# Altium schematic sheet [12] - TK2560_uSD.SchDoc
size A4; SheetNumber: 13; SheetTotal: 15
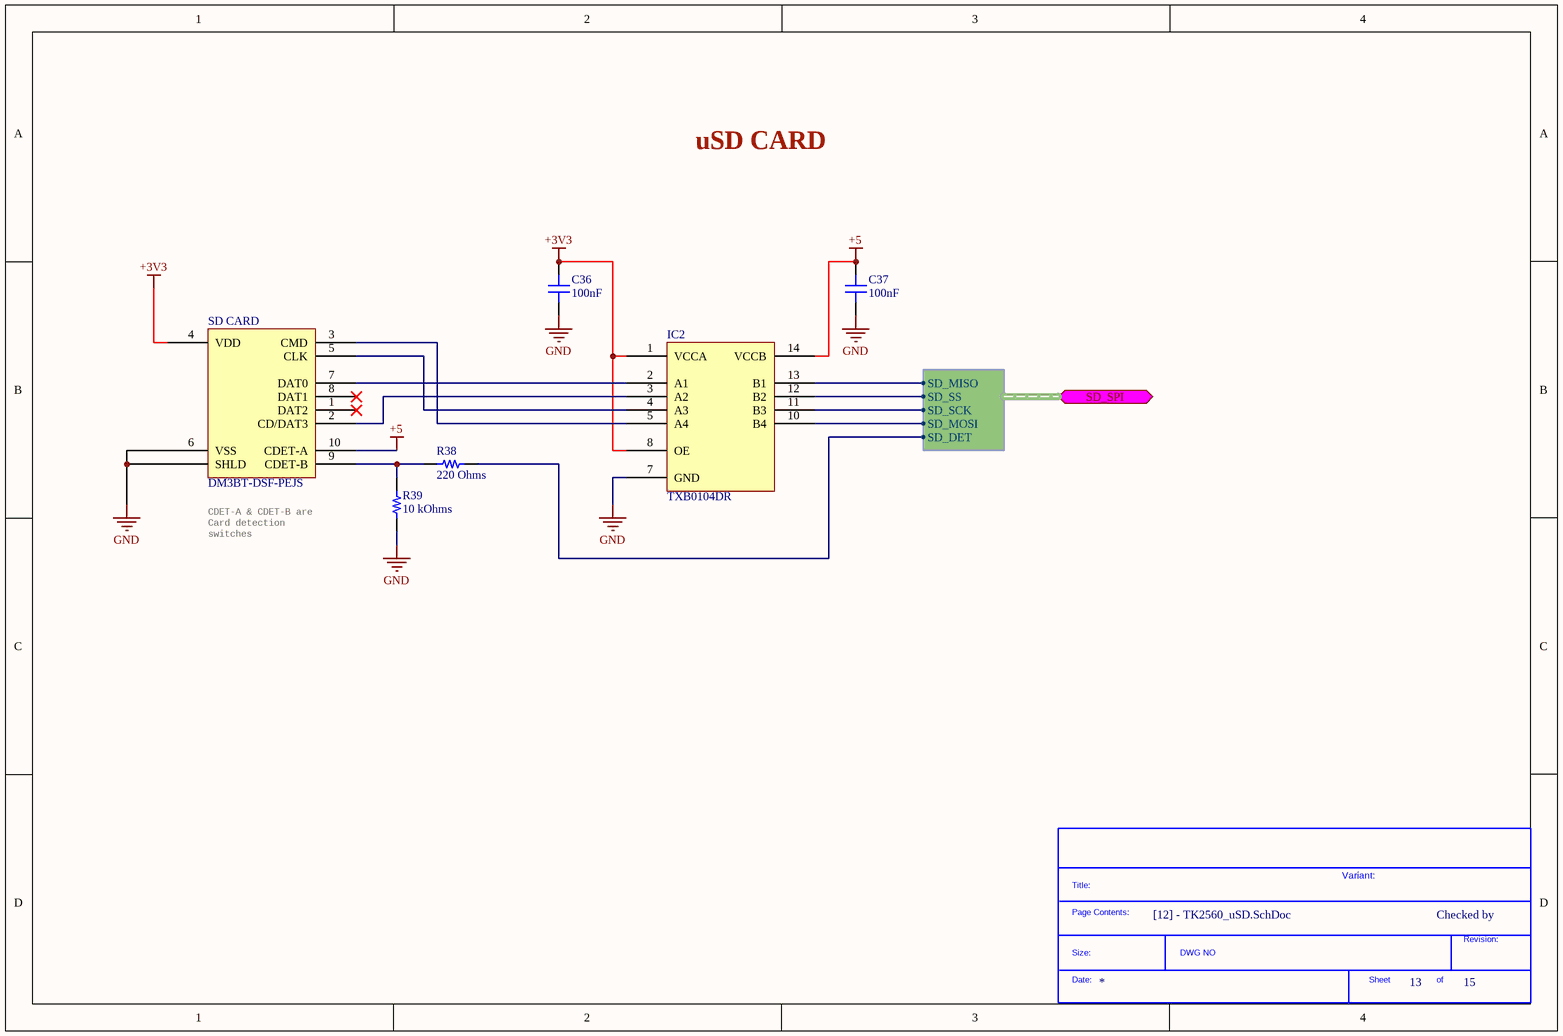
[diagram p0: [12] - TK2560_uSD.SchDoc]

## Parts
*?  SDTitleBlock  (value not drawn)  (graphical)
C36  100nF  [CAP 0805_2012]
C37  100nF  [CAP 0805_2012]
IC2  TXB0104DR  [TI SOIC-14 D]
R38  220 Ohms  [RES 0805_2012]
R39  10 kOhms  [RES 0805_2012]
SD_CARD  DM3BT-DSF-PEJS  [HIROSE DM3BT-DSF-PEJS]

## Ports
SD_SPI (bidir, harness SD_SPI)

## Harnesses
SD_SPI: SD_MISO, SD_SS, SD_SCK, SD_MOSI, SD_DET

## Nets
+3V3: C36.2 IC2.1(VCCA) IC2.8(OE) SD_CARD.4(VDD)
+5: C37.2 IC2.14(VCCB) SD_CARD.10(CDET-A)
GND: C36.1 C37.1 IC2.7(GND) R39.2 SD_CARD.6(VSS) SD_CARD.S(SHLD)
NetIC2_2: IC2.2(A1) SD_CARD.7(DAT0)
NetIC2_3: IC2.3(A2) SD_CARD.2(CD/DAT3)
NetIC2_4: IC2.4(A3) SD_CARD.5(CLK)
NetIC2_5: IC2.5(A4) SD_CARD.3(CMD)
NetIC2_10: IC2.10(B4) ; port SD_SPI.SD_MOSI
NetIC2_11: IC2.11(B3) ; port SD_SPI.SD_SCK
NetIC2_12: IC2.12(B2) ; port SD_SPI.SD_SS
NetIC2_13: IC2.13(B1) ; port SD_SPI.SD_MISO
NetR38_1: R38.1 R39.1 SD_CARD.9(CDET-B)
NetR38_2: R38.2 ; port SD_SPI.SD_DET

Not connected (* = marked no-connect by the designer): SD_CARD 1(DAT2)* 8(DAT1)*

## Notes on the sheet
- uSD CARD
- (near SD_CARD) CDET-A & CDET-B are Card detection switches
- Variant:
- Checked by
- (in symbol SDTitleBlock) Title:; Page Contents:; Revision:; Size:; DWG NO; Date:; Sheet; of

## Library data of the parts
C36 C37 = AC0805KKX8R9BB104: CAP CER 0805 10% X8R 50V 100NF; Manufacturer: Yageo; Capacitance: 0.1µF; Part Number: AC0805KKX8R9BB104; Value: 100nF; Applications: Automotive; ComponentLink1Description: Datasheet; ComponentLink1URL: http://www.yageo.com/documents/recent/AC0805KKX8R9BB104.pdf; ComponentLink2Description: DigiKey Link; ComponentLink2URL: http://digikey.com/product-detail/en/yageo/AC0805KKX8R9BB104/311-4624-1-ND/9699550; Device Package: 0805 (2012 Metric); LastUpdated: 02/09/2020 01:04:20; Lifecycle Status: Active; Minimum Order: 1; Mounting Type: Surface Mount, MLCC; Operating Temperature: -55°C ~ 150°C; Package / Case: 0805 (2012 Metric); Packaging: TapeAndReel; PartId: 14076; Part Status: Active; Price: 0.06; Ratings: AEC-Q200; Series: AC; Size / Dimension: 0.079" L x 0.049" W (2.00mm x 1.25mm); Supplier 1: DigiKey; Supplier Part Number 1: 311-4624-1-ND; Temperature Coefficient: X8R; Thickness (Max): 0.057" (1.45mm); Tolerance: ±10%; Voltage - Rated: 50V
IC2 = TXB0104DR: IC TRNSLTR BIDIRECTIONAL 14SOIC; Manufacturer: Texas Instruments; Channels per Circuit: 4; Data Rate: 100Mbps; Number of Circuits: 1; Output Type: Tri-State, Non-Inverted; Translator Type: Voltage Level; Voltage - VCCA: 1.2V ~ 3.6V; Voltage - VCCB: 1.65V ~ 5.5V; Part Number: TXB0104DR; Channel Type: Bidirectional; ComponentLink1Description: Datasheet; ComponentLink1URL: http://www.ti.com/general/docs/suppproductinfo.tsp?distId=10&gotoUrl=http%3A%2F%2Fwww.ti.com%2Flit%2Fgpn%2Ftxb0104; ComponentLink2Description: DigiKey Link; ComponentLink2URL: http://digikey.com/product-detail/en/texas-instruments/TXB0104DR/296-21928-1-ND/1629281; Device Package: 14-SOIC (0.154", 3.90mm Width); Features: Auto-Direction Sensing; LastUpdated: 13/05/2020 17:06:13; Lifecycle Status: Active; Minimum Order: 1; Mounting Type: Surface Mount; Operating Temperature: -40°C ~ 85°C (TA); Package / Case: 14-SOIC (0.154", 3.90mm Width); Packaging: TapeAndReel; Part Status: Active; Price: 0.54; Series: -; Supplier 1: DigiKey; Supplier Part Number 1: 296-21928-1-ND; Supplier Device Package: 14-SOIC
R38 = ERJ-6ENF2200V: RES SMD 220 OHM 1% 1/8W 0805; Manufacturer: Panasonic Electronic Components; Power (Watts): 0.125W, 1/8W; Temperature Coefficient: ±100ppm/°C; Part Number: ERJ-6ENF2200V; Value: 220 Ohms; ComponentLink1Description: Datasheet; ComponentLink1URL: https://industrial.panasonic.com/cdbs/www-data/pdf/RDA0000/AOA0000C304.pdf; ComponentLink2Description: DigiKey Link; ComponentLink2URL: http://digikey.com/product-detail/en/panasonic-electronic-components/ERJ-6ENF2200V/P220CCT-ND/1746831; Composition: Thick Film; Device Package: 0805 (2012 Metric); Features: Automotive AEC-Q200; Height - Seated (Max): 0.028" (0.70mm); LastUpdated: 02/09/2020 01:15:19; Lifecycle Status: Active; Minimum Order: 1; Number of Terminations: 2; Operating Temperature: -55°C ~ 155°C; Package / Case: 0805 (2012 Metric); Packaging: TapeAndReel; PartId: 30101; Part Status: Active; Price: 0.01; Ratings: AEC-Q200; Resistance: 220 Ohms; Series: ERJ; Size / Dimension: 0.079" L x 0.049" W (2.00mm x 1.25mm); Supplier 1: DigiKey; Supplier Part Number 1: P220CCT-ND; Supplier Device Package: 0805; Tolerance: ±1%
R39 = CPF0805B10KE: RES SMD 10K OHM 0.1% 1/10W 0805; Manufacturer: TE Connectivity Passive Product; Power (Watts): 0.1W, 1/10W; Temperature Coefficient: ±25ppm/°C; Part Number: CPF0805B10KE; Value: 10 kOhms; ComponentLink1Description: Datasheet; ComponentLink1URL: https://www.te.com/commerce/DocumentDelivery/DDEController?Action=srchrtrv&DocNm=1773200&DocType=DS&DocLang=English; ComponentLink2Description: DigiKey Link; ComponentLink2URL: http://digikey.com/product-detail/en/te-connectivity-passive-product/CPF0805B10KE/A106043CT-ND/3477679; Composition: Thin Film; Device Package: 0805 (2012 Metric); Height - Seated (Max): 0.026" (0.65mm); LastUpdated: 02/09/2020 01:15:24; Lifecycle Status: Active; Minimum Order: 1; Number of Terminations: 2; Operating Temperature: -55°C ~ 155°C; Package / Case: 0805 (2012 Metric); Packaging: TapeAndReel; PartId: 27724; Part Status: Active; Price: 0.09; Resistance: 10 kOhms; Series: CPF, Neohm; Size / Dimension: 0.079" L x 0.049" W (2.00mm x 1.25mm); Supplier 1: DigiKey; Supplier Part Number 1: A106043CT-ND; Supplier Device Package: 0805; Tolerance: ±0.1%
SD_CARD = DM3BT-DSF-PEJS: CONN MICRO SD CARD PUSH-PUSH R/A; Manufacturer: Hirose Electric Co Ltd; Card Type: Secure Digital - microSD™; Connector Type: Connector and Ejector; Insertion, Removal Method: Push In, Push Out; Number of Positions: 10 (8 + 2); Part Number: DM3BT-DSF-PEJS; ComponentLink1Description: Datasheet; ComponentLink1URL: https://www.hirose.com/product/download/?distributor=digikey&type=specSheet&lang=en&num=DM3BT-DSF-PEJS; ComponentLink2Description: DigiKey Link; ComponentLink2URL: //digikey.com/product-detail/en/hirose-electric-co-ltd/DM3BT-DSF-PEJS/HR1942TR-ND/1982749; Contact Finish: Gold; Features: Switch; Height Above Board: 0.072" (1.83mm); LastUpdated: 16/12/2019 20:35:34; Lifecycle Status: 0; Minimum Order: 1; Mounting Feature: Reverse - Bottom; Mounting Type: Surface Mount, Right Angle; Packaging: TapeAndReel; Part Status: Active; Price: 1.25; Series: DM3; Supplier 1: DigiKey; Supplier Part Number 1: HR1942TR-ND